# Altium schematic sheet Sheet1.SchDoc
size A
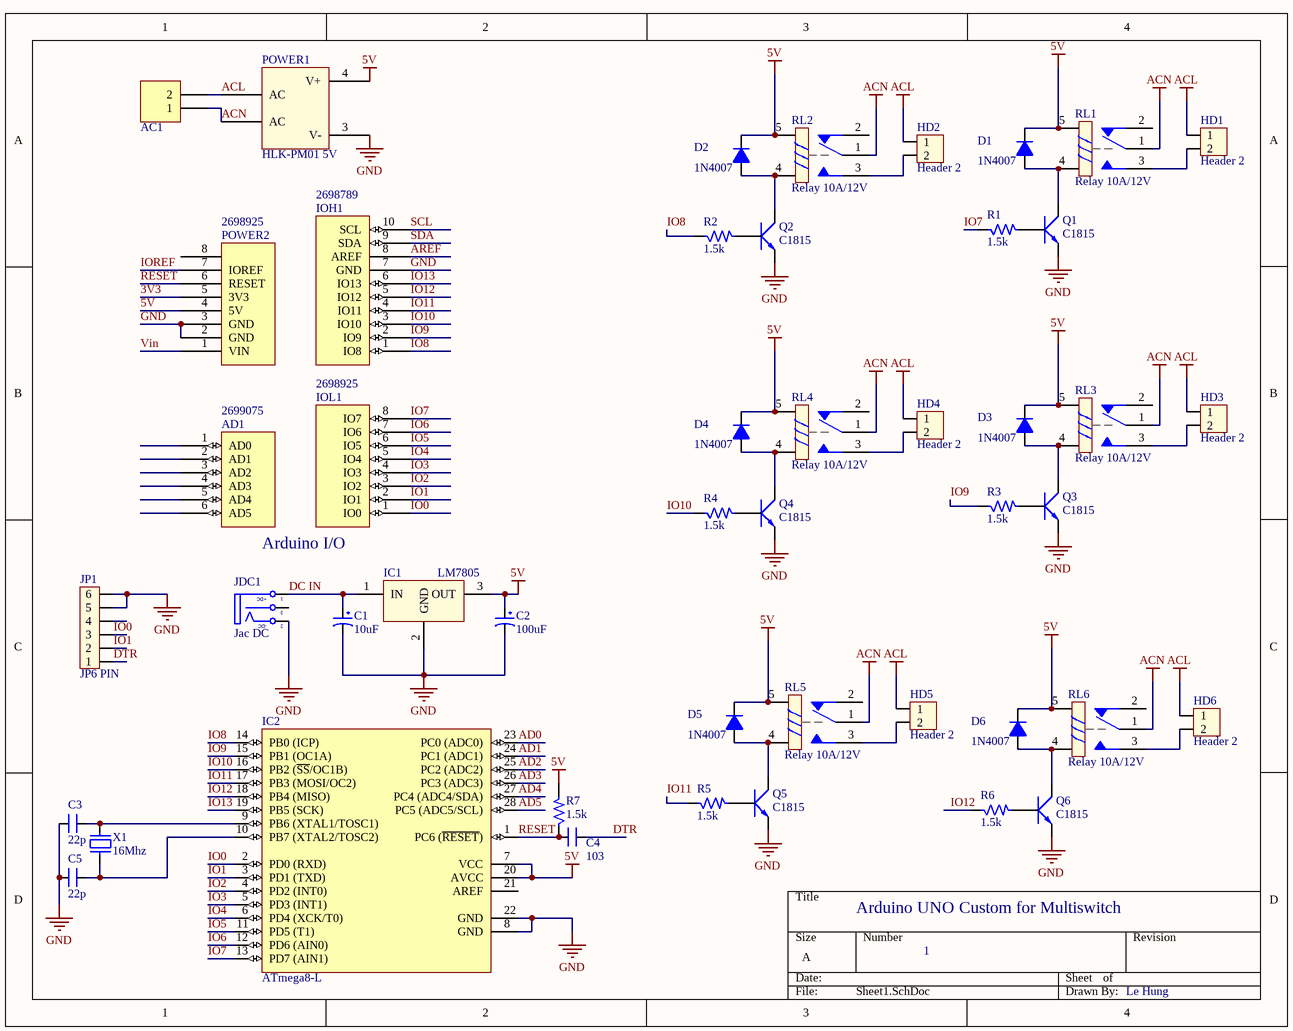
[diagram p0: Sheet1.SchDoc]

## Parts
AC1  Header 2_1  [HED2]  (value not drawn)
AD1  Supplier Part Number 4: 2699075  [Header 6x1 8.5mm]  (hidden comment: AD)
C1  10uF  [CP1/2]
C2  100uF  [CP1/2]
C3  22p  [CN1.5]
C4  103  [CN1.5]
C5  22p  [CN1.5]
D1  1N4007  [D1A]
D2  1N4007  [D1A]
D3  1N4007  [D1A]
D4  1N4007  [D1A]
D5  1N4007  [D1A]
D6  1N4007  [D1A]
HD1  Header 2  [HED2]
HD2  Header 2  [HED2]
HD3  Header 2  [HED2]
HD4  Header 2  [HED2]
HD5  Header 2  [HED2]
HD6  Header 2  [HED2]
IC1  LM7805  [QTO-220]
IC2  ATmega8-L  [DIP28/W0.3]
IOH1  Supplier Part Number 3: 2698789  [Header 10x1 8.5mm]  (hidden comment: IOH)
IOL1  Supplier Part Number 4: 2698925  [Header 8x1 8.5mm]  (hidden comment: IOL)
JDC1  Jac DC  [DC-IN]
JP1  JP6 PIN  [JP6]
POWER1  HLK-PM01 5V  [HK LINK]
POWER2  Supplier Part Number 4: 2698925  [Header 8x1 8.5mm]  (hidden comment: POWER_UNO)
Q1  C1815  [QTO-92]
Q2  C1815  [QTO-92]
Q3  C1815  [QTO-92]
Q4  C1815  [QTO-92]
Q5  C1815  [QTO-92]
Q6  C1815  [QTO-92]
R1  1.5k  [R1/4W]
R2  1.5k  [R1/4W]
R3  1.5k  [R1/4W]
R4  1.5k  [R1/4W]
R5  1.5k  [R1/4W]
R6  1.5k  [R1/4W]
R7  1.5k  [R1/4W]
RL1  Relay 10A/12V  [RL_SPDT_10A]
RL2  Relay 10A/12V  [RL_SPDT_10A]
RL3  Relay 10A/12V  [RL_SPDT_10A]
RL4  Relay 10A/12V  [RL_SPDT_10A]
RL5  Relay 10A/12V  [RL_SPDT_10A]
RL6  Relay 10A/12V  [RL_SPDT_10A]
X1  16Mhz  [XT2]

## Nets
5V: C2.1 D1.2(K) D2.2(K) D3.2(K) D4.2(K) D5.2(K) D6.2(K) IC1.3(OUT) IC2.7(VCC) IC2.20(AVCC) POWER1.4(V+) POWER2.4(5V) R7.2 RL1.5 RL2.5 RL3.5 RL4.5 RL5.5 RL6.5
ACL: AC1.2 HD1.1 HD2.1 HD3.1 HD4.1 HD5.1 HD6.1 POWER1.2(AC)
ACN: AC1.1 POWER1.1(AC) RL1.1 RL2.1 RL3.1 RL4.1 RL5.1 RL6.1
GND: C1.2 C2.2 C3.1 C5.1 IC1.2(GND) IC2.8(GND) IC2.22(GND) IOH1.7(GND) JDC1.2(TN) JP1.5 JP1.6 POWER1.3(V-) POWER2.2(GND) POWER2.3(GND) Q1.1(E) Q2.1(E) Q3.1(E) Q4.1(E) Q5.1(E) Q6.1(E)
3V3: POWER2.5(3V3)
AD0: IC2.23(PC0_(ADC0))
AD1: IC2.24(PC1_(ADC1))
AD2: IC2.25(PC2_(ADC2))
AD3: IC2.26(PC3_(ADC3))
AD4: IC2.27(PC4_(ADC4/SDA))
AD5: IC2.28(PC5_(ADC5/SCL))
AREF: IOH1.8(AREF)
DC IN: C1.1 IC1.1(IN) JDC1.1(T)
DTR: C4.2 JP1.1
IO0: IC2.2(PD0_(RXD)) IOL1.1(IO0) JP1.3
IO1: IC2.3(PD1_(TXD)) IOL1.2(IO1) JP1.2
IO2: IC2.4(PD2_(INT0)) IOL1.3(IO2)
IO3: IC2.5(PD3_(INT1)) IOL1.4(IO3)
IO4: IC2.6(PD4_(XCK/T0)) IOL1.5(IO4)
IO5: IC2.11(PD5_(T1)) IOL1.6(IO5)
IO6: IC2.12(PD6_(AIN0)) IOL1.7(IO6)
IO7: IC2.13(PD7_(AIN1)) IOL1.8(IO7) R1.1
IO8: IC2.14(PB0_(ICP)) IOH1.1(IO8) R2.1
IO9: IC2.15(PB1_(OC1A)) IOH1.2(IO9) R3.1
IO10: IC2.16(PB2_(~{SS}/OC1B)) IOH1.3(IO10) R4.1
IO11: IC2.17(PB3_(MOSI/OC2)) IOH1.4(IO11) R5.1
IO12: IC2.18(PB4_(MISO)) IOH1.5(IO12) R6.1
IO13: IC2.19(PB5_(SCK)) IOH1.6(IO13)
IOREF: POWER2.7(IOREF)
RESET: C4.1 IC2.1(PC6_(~{RESET})) POWER2.6(RESET) R7.1
SCL: IOH1.10(SCL)
SDA: IOH1.9(SDA)
Vin: POWER2.1(VIN)
NetC3_2: C3.2 IC2.9(PB6_(XTAL1/TOSC1)) X1.2
NetC5_2: C5.2 IC2.10(PB7_(XTAL2/TOSC2)) X1.1
NetD1_1: D1.1(A) Q1.2(C) RL1.4
NetD2_1: D2.1(A) Q2.2(C) RL2.4
NetD3_1: D3.1(A) Q3.2(C) RL3.4
NetD4_1: D4.1(A) Q4.2(C) RL4.4
NetD5_1: D5.1(A) Q5.2(C) RL5.4
NetD6_1: D6.1(A) Q6.2(C) RL6.4
NetHD1_2: HD1.2 RL1.3
NetHD2_2: HD2.2 RL2.3
NetHD3_2: HD3.2 RL3.3
NetHD4_2: HD4.2 RL4.3
NetHD5_2: HD5.2 RL5.3
NetHD6_2: HD6.2 RL6.3
NetQ1_3: Q1.3(B) R1.2
NetQ2_3: Q2.3(B) R2.2
NetQ3_3: Q3.3(B) R3.2
NetQ4_3: Q4.3(B) R4.2
NetQ5_3: Q5.3(B) R5.2
NetQ6_3: Q6.3(B) R6.2

Not connected (* = marked no-connect by the designer): AD1 1(AD0) 2(AD1) 3(AD2) 4(AD3) 5(AD4) 6(AD5); IC2 21(AREF); JDC1 3(S); JP1 4; POWER2 8; RL1 2; RL2 2; RL3 2; RL4 2; RL5 2; RL6 2

## Notes on the sheet
- Arduino I/O
- Arduino UNO Custom for Multiswitch
- 1
- Le Hung
- (in symbol DCIN) +DC; -DC

## Library data of the parts
AC1 = Header 2_1: Header, 2-Pin; Manufacturer: Generic Components; Class: Connector; Value: Header 2
C1 C2 = CP1: Cap P  0,1uF < 22uF , 16 - 50V; Value: 10uF/50V; Description 1: 10 => 220uF/6,3V/10V - 10uF => 100uF/16V; Description 2: 0,1uF => 33uF/50V - 10uF => 22uF/63V; Description 3: 0,47uF => 10uF/100V
C3-C5 = CN1.5: Cap np 682pF => 104pF; Value: 0.01uF
D1-D6 = D1A: Diode 1A; Value: 1N4007
HD1-HD6 = Hed2: Header 2 (Green); Value: Header 2
IC1 = LM78xx: On ap +, from + 5 to + 24VDC; Value: LM7805
IC2 = ATmega8-L: 8-Bit AVR Microcontroller with 8K Bytes of In-System Programmable Flash Memory; Value: ATmega8-L
JDC1 = DCIN: Jac DC input; Value: Jac DC
JP1 = JP6: Value: JP7
POWER1 = Hi link: Hi-link HLK-PM01
Q1-Q6 = C1815: NPN 600mW, ECB; Value: C1815
R1-R7 = R: Resistor 1/4W; Value: R1/4W - 1K
RL1-RL6 = Relay 1: Relay SPDT,10A - 12VDC 5 Pin; Value: Relay SPDT, 10A, 12V
X1 = XT2: Crystal For all Crystal 2pin.; Value: 4Mhz
AD1 = AD: Supplier 1: Arrow; Supplier Part Number 1: 2699089; Supplier 2: Digi-Key; Supplier Part Number 2: SAM1198-06-ND; Supplier 3: Arrow; Supplier Part Number 3: 2699088; Supplier 4: Arrow
IOH1 = IOH: Supplier 1: Arrow; Supplier Part Number 1: 2698803S4475693N1004; Supplier 2: Digi-Key; Supplier Part Number 2: SAM1198-10-ND; Supplier 3: Arrow
IOL1 = IOL: Supplier 1: Digi-Key; Supplier Part Number 1: SAM1198-08-ND; Supplier 2: Arrow; Supplier Part Number 2: 2698939; Supplier 3: Arrow; Supplier Part Number 3: 2698940; Supplier 4: Arrow
POWER2 = POWER_UNO: Supplier 1: Digi-Key; Supplier Part Number 1: SAM1198-08-ND; Supplier 2: Arrow; Supplier Part Number 2: 2698939; Supplier 3: Arrow; Supplier Part Number 3: 2698940; Supplier 4: Arrow